# Altium schematic sheet AuxSupply_USB.SchDoc
size A4; SheetNumber: 6; SheetTotal: 10
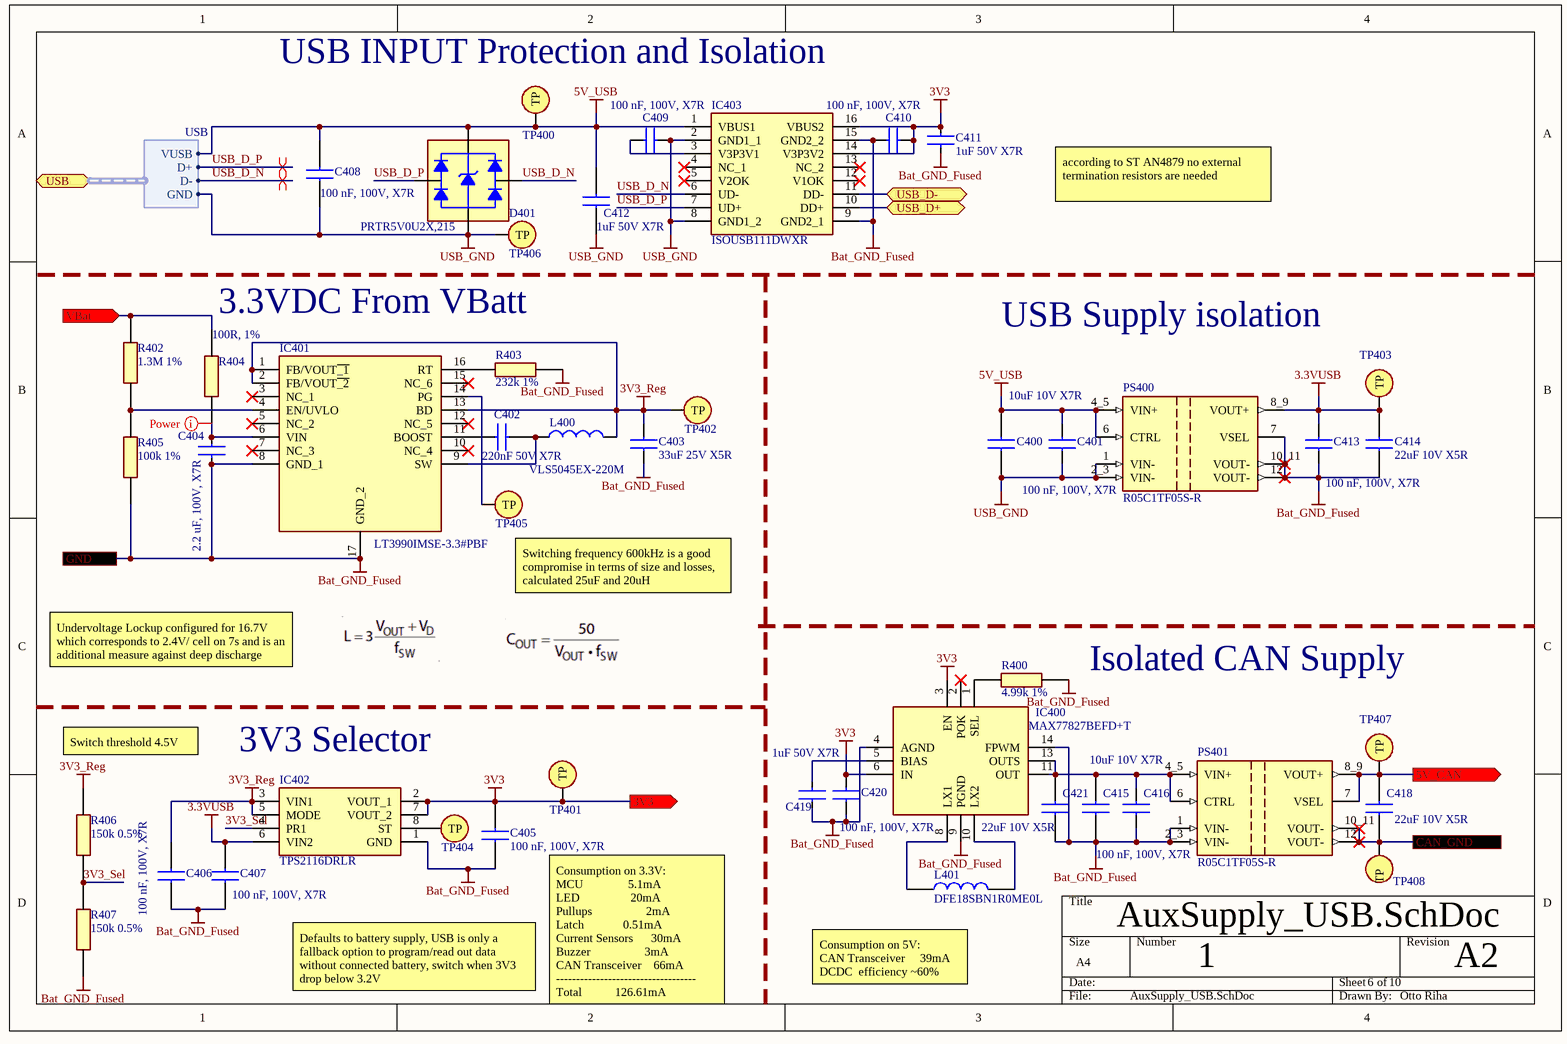
[diagram p0: AuxSupply_USB.SchDoc]

## Parts
C400  10uF 10V X7R  [GRM18x]
C401  100 nF, 100V, X7R  [MAJx16]
C402  220nF 50V X7R  [GRM18x]
C403  33uF 25V X5R  [CAPC3216X180N]
C404  2.2 uF, 100V, X7R  [CAPC2012X145N]
C405  100 nF, 100V, X7R  [MAJx16]
C406  100 nF, 100V, X7R  [MAJx16]
C407  100 nF, 100V, X7R  [MAJx16]
C408  100 nF, 100V, X7R  [MAJx16]
C409  100 nF, 100V, X7R  [MAJx16]
C410  100 nF, 100V, X7R  [MAJx16]
C411  1uF 50V X7R  [CAPC1608X90N]
C412  1uF 50V X7R  [CAPC1608X90N]
C413  100 nF, 100V, X7R  [MAJx16]
C414  22uF 10V X5R  [CAPC1608X105N]
C415  10uF 10V X7R  [GRM18x]
C416  100 nF, 100V, X7R  [MAJx16]
C418  22uF 10V X5R  [CAPC1608X105N]
C419  1uF 50V X7R  [CAPC1608X90N]
C420  100 nF, 100V, X7R  [MAJx16]
C421  22uF 10V X5R  [CAPC1608X105N]
D401  PRTR5V0U2X,215  [PRTR5V0U2X]
IC400  MAX77827BEFD+T  [MAX77827BEFDT]
IC401  LT3990IMSE-3.3#PBF  [SOP50P490X110-17N]
IC402  TPS2116DRLR  [SOTFL50P160X60-8N]
IC403  ISOUSB111DWXR  [SOP65P1030X260-16N]
L400  VLS5045EX-220M  [VLS5045EX330M]
L401  DFE18SBN1R0ME0L  [DFE18SAN1R0ME0L]
PS400  R05C1TF05S-R  [CONV_R05C1TF05S-R]
PS401  R05C1TF05S-R  [CONV_R05C1TF05S-R]
R400  4.99k 1%  [RESC0603X26N]
R402  1.3M 1%  [RESC1608X55N]
R403  232k 1%  [RESC1608X50N]
R404  100R, 1%  [RESC1608X50N]
R405  100k 1%  [RESC1608X55N]
R406  150k 0.5%  [ERA3AEB101V]
R407  150k 0.5%  [ERA3AEB101V]
TP400  Testpoint  [Testpoint]  (value not drawn)
TP401  Testpoint  [Testpoint]  (value not drawn)
TP402  Testpoint  [Testpoint]  (value not drawn)
TP403  Testpoint  [Testpoint]  (value not drawn)
TP404  Testpoint  [Testpoint]  (value not drawn)
TP405  Testpoint  [Testpoint]  (value not drawn)
TP406  Testpoint  [Testpoint]  (value not drawn)
TP407  Testpoint  [Testpoint]  (value not drawn)
TP408  Testpoint  [Testpoint]  (value not drawn)

## Ports
3V3 (out, see Main[4D], MCU[1A], PowerPath[1B], Singlepath[1B]), 5V_CAN (out, see Main[4D], MCU[1C]), CAN_GND (see Main[4D], MCU[1C]), GND (see Main[4D], LTC_Hardware[1D], MCU[1A], PowerPath[1B], Singlepath[1C]), USB (bidir, harness USB, see Main[4D]), USB_D+ (bidir, see Main[4D], MCU[4C]), USB_D- (bidir, see Main[4D], MCU[4C]), VBat (in, see Main[4D])

## Harnesses
USB: VUSB, D+, D-, GND

## Nets
3.3VUSB: C407.2 C413.1 C414.2 IC402.6(VIN2) PS400.8_9(VOUT+) TP403.1(TP)
3V3: C405.2 C410.1 C411.2 C420.1 IC400.3(EN) IC400.6(IN) IC402.2(VOUT_1) IC402.7(VOUT_2) IC403.14(V3P3V2) IC403.16(VBUS2) TP401.1(TP) ; port 3V3
3V3_Reg: C403.2 C406.2 IC401.1(FB/VOUT~{_1}) IC401.2(FB/VOUT~{_2}) IC401.13(BD) IC402.3(VIN1) IC402.5(MODE) L400.2 R406.2 TP402.1(TP)
5V_USB: C400.2 C401.1 C408.2 C412.1 D401.4(supply_voltage) IC403.1(VBUS1) PS400.4_5(VIN+) PS400.6(CTRL) TP400.1(TP) ; port USB.VUSB
Bat_GND_Fused: C403.1 C404.1 C405.1 C406.1 C407.1 C410.2 C411.1 C413.2 C414.1 C415.1 C416.2 C419.1 C420.2 C421.1 IC400.4(AGND) IC400.9(PGND) IC400.14(FPWM) IC401.8(GND_1) IC401.17(GND_2) IC402.1(GND) IC403.9(GND2_1) IC403.15(GND2_2) PS400.7(VSEL) PS400.10_11(VOUT-) PS400.12(VOUT-) PS401.1(VIN-) PS401.2_3(VIN-) R400.2 R403.2 R405.1 R407.1 ; port GND
USB_GND: C400.1 C401.2 C408.1 C409.1 C412.2 D401.1(ground) IC403.2(GND1_1) IC403.8(GND1_2) PS400.1(VIN-) PS400.2_3(VIN-) TP406.1(TP) ; port USB.GND
3V3_Sel: IC402.4(PR1) R406.1 R407.2
5V_CAN: C418.2 PS401.7(VSEL) PS401.8_9(VOUT+) TP407.1(TP) ; port 5V_CAN
CAN_GND: C418.1 PS401.10_11(VOUT-) PS401.12(VOUT-) TP408.1(TP) ; port CAN_GND
USB_D+: IC403.10(DD+) ; port USB_D+
USB_D-: IC403.11(DD-) ; port USB_D-
USB_D_N: D401.3(input/output_2) IC403.6(UD-) ; port USB.D-
USB_D_P: D401.2(input/output_1) IC403.7(UD+) ; port USB.D+
VBat: R402.2 R404.2 ; port VBat
NetC402_1: C402.1 IC401.11(BOOST)
NetC402_2: C402.2 IC401.9(SW) L400.1
NetC404_2: C404.2 IC401.6(VIN) R404.1
NetC409_2: C409.2 IC403.3(V3P3V1)
NetC415_2: C415.2 C416.1 C421.2 IC400.11(OUT) IC400.13(OUTS) PS401.4_5(VIN+) PS401.6(CTRL)
NetC419_2: C419.2 IC400.5(BIAS)
NetIC400_1: IC400.1(SEL) R400.1
NetIC400_8: IC400.8(LX1) L401.1
NetIC400_10: IC400.10(LX2) L401.2
NetIC401_4: IC401.4(EN/UVLO) R402.1 R405.2
NetIC401_14: IC401.14(PG) TP405.1(TP)
NetIC401_16: IC401.16(RT) R403.1
NetIC402_8: IC402.8(ST) TP404.1(TP)

Not connected (* = marked no-connect by the designer): IC400 2(POK)*; IC401 3(NC_1)* 5(NC_2)* 7(NC_3)* 10(NC_4)* 12(NC_5)* 15(NC_6)*; IC403 4(NC_1)* 5(V2OK)* 12(V1OK)* 13(NC_2)*

## Layout directives
differential pair: USB_D_N, USB_D_P
net class Batt+: NetC404_2

## Notes on the sheet
- USB INPUT Protection and Isolation
- according to ST AN4879 no external termination resistors are needed
- 3.3VDC From VBatt
- USB Supply isolation
- (near TP405) Switching frequency 600kHz is a good compromise in terms of size and losses, calculated 25uF and 20uH
- Undervoltage Lockup configured for 16.7V which corresponds to 2.4V/ cell on 7s and is an additional measure against deep discharge
- Isolated CAN Supply
- Switch threshold 4.5V
- (near IC402) 3V3 Selector
- Defaults to battery supply, USB is only a fallback option to program/read out data without connected battery, switch when 3V3 drop below 3.2V
- (near L401) Consumption on 5V:
  CAN Transceiver     39mA
  DCDC  efficiency ~60%
- 1
- A2
- Consumption on 3.3V:
  MCU 	             5.1mA
  LED  	              20mA
  Pullups 	                2mA
  Latch 	           0.51mA
  Current Sensors      30mA
  Buzzer 	                3mA
  CAN Transceiver    66mA
  -----------------------------------
  Total 	         126.61mA
- Otto Riha

## Library data of the parts
C400 C415 = GRM188Z71A106MA73D: Capacitor; Manufacturer_Name: Murata Electronics; Datasheet Link: https://search.murata.co.jp/Ceramy/image/img/A01X/G101/ENG/GRM188Z71A106MA73-01A.pdf; Height: 0.9mm; Manufacturer_Part_Number: GRM188Z71A106MA73D; Mouser Part Number: 81-GRM188Z71A106MA3D; Mouser Price/Stock: https://www.mouser.co.uk/ProductDetail/Murata-Electronics/GRM188Z71A106MA73D?qs=Y%252BBGkTaltXt4aDn0%2FsxyNQ%3D%3D; Arrow Part Number: GRM188Z71A106MA73D; Arrow Price/Stock: https://www.arrow.com/en/products/grm188z71a106ma73d/murata-manufacturing?utm_currency=USD&region=europe
C401 C405-C410 C413 C416 C420 = MAJCH168BB7104KTEA01: Capacitor 100nF, 100V, X7R; Manufacturer_Name: TAIYO YUDEN; Datasheet Link: https://ds.yuden.co.jp/TYCOMPAS/or/detail?pn=MAJCH168BB7104KTEA01; Height: 0.8mm; Manufacturer_Part_Number: MAJCH168BB7104KTEA01; Mouser Part Number: 963-MAJCH168BB7104KT; Mouser Price/Stock: https://www.mouser.co.uk/ProductDetail/TAIYO-YUDEN/MAJCH168BB7104KTEA01?qs=ZcfC38r4PovaTBrG0IdezQ%3D%3D; Arrow Part Number: MAJCH168BB7104KTEA01; Arrow Price/Stock: https://www.arrow.com/en/products/majch168bb7104ktea01/taiyo-yuden?utm_currency=USD&region=nac; Supplier 1: Mouser; Supplier Part Number 1: 963-MAJCH168BB7104KT
C402 = GRM188R71H224KAC4J: Capacitor; Manufacturer_Name: Murata Electronics; Datasheet Link: https://search.murata.co.jp/Ceramy/image/img/A01X/G101/ENG/GRM188R71H224KAC4-01A.pdf; Height: 0.9mm; Manufacturer_Part_Number: GRM188R71H224KAC4J; Mouser Part Number: 81-GRM188R71H224KA4J; Mouser Price/Stock: https://www.mouser.co.uk/ProductDetail/Murata-Electronics/GRM188R71H224KAC4J?qs=jHkklCh7amjbWVXSvnFGBA%3D%3D; Arrow Part Number: GRM188R71H224KAC4J; Arrow Price/Stock: https://www.arrow.com/en/products/grm188r71h224kac4j/murata-manufacturing
C403 = C3216X5R1E336M160AC: Capacitor 33uF 25V X5R; Manufacturer_Name: TDK; Datasheet Link: https://product.tdk.com/info/en/catalog/datasheets/mlcc_commercial_midvoltage_en.pdf; Height: 1.8mm; Manufacturer_Part_Number: C3216X5R1E336M160AC; Mouser Part Number: 810-C3216X5R1E336M; Mouser Price/Stock: https://www.mouser.co.uk/ProductDetail/TDK/C3216X5R1E336M160AC?qs=LcTL%2F5vFEzFIMvFz4LzwTw%3D%3D; Arrow Part Number: C3216X5R1E336M160AC; Arrow Price/Stock: https://www.arrow.com/en/products/c3216x5r1e336m160ac/tdk
C404 = C2012X7R2A225K125AC: Capacitor 2.2 uF, 100V, X7R; Manufacturer_Name: TDK; Datasheet Link: https://product.tdk.com/info/en/catalog/datasheets/mlcc_commercial_midvoltage_en.pdf; Height: 1.45mm; Manufacturer_Part_Number: C2012X7R2A225K125AC; Mouser Part Number: 810-C2012X7R2225K125; Mouser Price/Stock: https://www.mouser.co.uk/ProductDetail/TDK/C2012X7R2A225K125AC?qs=17ckDYBRdekDf%2FwiwHq7Mg%3D%3D; Arrow Part Number: C2012X7R2A225K125AC; Arrow Price/Stock: https://www.arrow.com/en/products/c2012x7r2a225k125ac/tdk?utm_currency=USD&region=nac; Supplier 1: Mouser; Supplier Part Number 1: 810-C2012X7R2225K125
C411 C412 C419 = 06035C105MAT2A: Capacitor 1uF 50V X7R; Manufacturer_Name: Kyocera AVX; Datasheet Link: https://componentsearchengine.com/Datasheets/1/06031A100FAT2A.pdf; Height: 0.9mm; Manufacturer_Part_Number: 06035C105MAT2A; Mouser Part Number: 581-06035C105MAT2A; Mouser Price/Stock: https://www.mouser.co.uk/ProductDetail/KYOCERA-AVX/06035C105MAT2A?qs=%252BdQmOuGyFcHMsevPtc6OZQ%3D%3D; Value: 1uF
C414 C418 C421 = CL10A226MP8NUNE: Capacitor; Manufacturer_Name: SAMSUNG; Datasheet Link: https://datasheet.datasheetarchive.com/originals/distributors/Datasheets-DGA10/2407063.pdf; Height: 1.05mm; Manufacturer_Part_Number: CL10A226MP8NUNE; Mouser Part Number: 187-CL10A226MP8NUNE; Mouser Price/Stock: https://www.mouser.co.uk/ProductDetail/Samsung-Electro-Mechanics/CL10A226MP8NUNE?qs=gRKWieUq2Hb5O0PTfRKzDQ%3D%3D; Arrow Part Number: CL10A226MP8NUNE; Arrow Price/Stock: https://www.arrow.com/en/products/cl10a226mp8nune/samsung-electro-mechanics?region=europe
D401 = PRTR5V0U2X,215: Diode; Manufacturer_Name: Nexperia; Datasheet Link: https://assets.nexperia.com/documents/data-sheet/PRTR5V0U2X.pdf; Height: 1.1mm; Manufacturer_Part_Number: PRTR5V0U2X,215; Mouser Part Number: 771-PRTR5V0U2X-T/R; Mouser Price/Stock: https://www.mouser.co.uk/ProductDetail/Nexperia/PRTR5V0U2X215?qs=LOCUfHb8d9sDkgY4cRj8Lw%3D%3D; Arrow Part Number: PRTR5V0U2X,215; Arrow Price/Stock: https://www.arrow.com/en/products/prtr5v0u2x215/nexperia?utm_currency=USD&region=europe
IC400 = MAX77827BEFD+T: Integrated Circuit; Manufacturer_Name: Analog Devices; Datasheet Link: https://www.analog.com/media/en/technical-documentation/data-sheets/MAX77827.pdf; Height: 0.6mm; Manufacturer_Part_Number: MAX77827BEFD+T; Mouser Part Number: 700-MAX77827BEFD+T; Mouser Price/Stock: https://www.mouser.co.uk/ProductDetail/Analog-Devices-Maxim-Integrated/MAX77827BEFD%2bT?qs=yqaQSyyJnNgFOTHEkqA3ww%3D%3D; Arrow Part Number: MAX77827BEFD+T; Arrow Price/Stock: https://www.arrow.com/en/products/max77827befdt/analog-devices?utm_currency=USD&region=nac
IC401 = LT3990IMSE-3.3#PBF: Integrated Circuit; Manufacturer_Name: Analog Devices; Datasheet Link: https://www.analog.com/LT3990/datasheet; Height: 1.1mm; Manufacturer_Part_Number: LT3990IMSE-3.3#PBF; Mouser Part Number: 584-3990IMSE-3.3PBF; Mouser Price/Stock: https://www.mouser.co.uk/ProductDetail/Analog-Devices/LT3990IMSE-3.3PBF?qs=hVkxg5c3xu8pU5y8AinUWQ%3D%3D; Arrow Part Number: LT3990IMSE-3.3#PBF; Arrow Price/Stock: https://www.arrow.com/en/products/lt3990imse-3.3pbf/analog-devices?region=nac
IC402 = TPS2116DRLR: Integrated Circuit; Manufacturer_Name: Texas Instruments; Datasheet Link: https://www.ti.com/lit/gpn/tps2116; Height: 0.6mm; Manufacturer_Part_Number: TPS2116DRLR; Mouser Part Number: 595-TPS2116DRLR; Mouser Price/Stock: https://www.mouser.co.uk/ProductDetail/Texas-Instruments/TPS2116DRLR?qs=aP1CjGhiNiGo3XAyXcVPaQ%3D%3D; Arrow Part Number: TPS2116DRLR; Arrow Price/Stock: https://www.arrow.com/en/products/tps2116drlr/texas-instruments?utm_currency=USD&region=nac
IC403 = ISOUSB111DWXR: Integrated Circuit; Manufacturer_Name: Texas Instruments; Datasheet Link: https://www.ti.com/lit/ds/symlink/isousb111.pdf?ts=1669697942868&ref_url=https%253A%252F%252Fwww.ti.com%252Fproduct%252FISOUSB111%253FkeyMatch%253DISOUSB111DWXR%2526tisearch%253Dsearch-everything%2526usecase%253DOPN; Height: 2.6mm; Manufacturer_Part_Number: ISOUSB111DWXR; Mouser Part Number: 595-ISOUSB111DWXR; Mouser Price/Stock: https://www.mouser.co.uk/ProductDetail/Texas-Instruments/ISOUSB111DWXR?qs=Y0Uzf4wQF3msEozH7EwD3g%3D%3D; Arrow Part Number: ISOUSB111DWXR; Arrow Price/Stock: https://www.arrow.com/en/products/isousb111dwxr/texas-instruments?region=nac
L400 = VLS5045EX-220M: Inductor; Manufacturer_Name: TDK; Datasheet Link: https://product.tdk.com/system/files/dam/doc/product/inductor/inductor/smd/catalog/inductor_commercial_power_vls5045ex_en.pdf; Height: 4mm; Manufacturer_Part_Number: VLS5045EX-220M; Mouser Part Number: 810-VLS5045EX-220M; Mouser Price/Stock: https://www.mouser.co.uk/ProductDetail/TDK/VLS5045EX-220M?qs=oF%2FSscNnLpAAQL9ec5VdpA%3D%3D; Arrow Part Number: VLS5045EX-220M; Arrow Price/Stock: https://www.arrow.com/en/products/vls5045ex-220m/tdk?region=nac
L401 = DFE18SBN1R0ME0L: Inductor; Manufacturer_Name: Murata Electronics; Datasheet Link: https://search.murata.co.jp/Ceramy/image/img/P02/JETE243A-0041.pdf; Height: 0.8mm; Manufacturer_Part_Number: DFE18SBN1R0ME0L; Mouser Part Number: 81-DFE18SBN1R0ME0L; Mouser Price/Stock: https://www.mouser.co.uk/ProductDetail/Murata-Electronics/DFE18SBN1R0ME0L?qs=byeeYqUIh0Mps9dQtDnpsA%3D%3D
PS400 PS401 = R05C1TF05S-R: MF: {'manufacturer': u'Recom Power'}; Package: None; Price: None; Value: *; MP: R05C1TF05S-R; Availability: Unavailable
R400 = CR0201-FW-4991GLF: Resistor; Manufacturer_Name: Bourns; Datasheet Link: https://www.bourns.com/pdfs/chpreztr.pdf; Height: 0.26mm; Manufacturer_Part_Number: CR0201-FW-4991GLF; Mouser Part Number: 652-CR0201FW-4991GLF; Mouser Price/Stock: https://www.mouser.co.uk/ProductDetail/Bourns/CR0201-FW-4991GLF?qs=W7X4MxMep48JtJbJXkcmpg%3D%3D
R402 = MCT0603MD1304BP500: Resistor 1.3M 1%; Manufacturer_Name: Vishay; Datasheet Link: http://www.vishay.com/docs/28705/mcx0x0xpro.pdf; Height: 0.55mm; Manufacturer_Part_Number: MCT0603MD1304BP500; Mouser Part Number: 594-MCT0603MD1304BP5; Mouser Price/Stock: https://www.mouser.co.uk/ProductDetail/Vishay/MCT0603MD1304BP500?qs=Jslch3jnSjn3NEL17BAJuQ%3D%3D; Value: 1.3M; Supplier 1: Mouser; Supplier Part Number 1: 594-MCT0603MD1304BP5
R403 = CRCW0603232KFKEA: Resistor; Manufacturer_Name: Vishay; Datasheet Link: http://www.vishay.com/docs/20035/dcrcwe3.pdf; Height: 0.5mm; Manufacturer_Part_Number: CRCW0603232KFKEA; Mouser Part Number: 71-CRCW0603-232K-E3; Mouser Price/Stock: https://www.mouser.co.uk/ProductDetail/Vishay-Dale/CRCW0603232KFKEA?qs=NHKSztHah43mx5UrSmXOxA%3D%3D; Arrow Part Number: CRCW0603232KFKEA; Arrow Price/Stock: https://www.arrow.com/en/products/crcw0603232kfkea/vishay
R404 = CRCW0603100RFKEA: Resistor 100R, 1%; Manufacturer_Name: Vishay; Datasheet Link: http://www.vishay.com/docs/20035/dcrcwe3.pdf; Height: 0.5mm; Manufacturer_Part_Number: CRCW0603100RFKEA; Mouser Part Number: 71-CRCW0603-100-E3; Mouser Price/Stock: https://www.mouser.co.uk/ProductDetail/Vishay-Dale/CRCW0603100RFKEA?qs=90AHS1y%2FsidGWjjxZAupKg%3D%3D; Arrow Part Number: CRCW0603100RFKEA; Arrow Price/Stock: https://www.arrow.com/en/products/crcw0603100rfkea/vishay?utm_currency=USD&region=europe; Value: 100R; Supplier 1: Mouser; Supplier Part Number 1: 71-CRCW0603-100-E3
R405 = CRCW0603100KFKEAC: Resistor 100k, 1%; Manufacturer_Name: Vishay; Datasheet Link: https://www.mouser.com/datasheet/2/427/crcwce3-1223726.pdf; Height: 0.55mm; Manufacturer_Part_Number: CRCW0603100KFKEAC; Mouser Part Number: 71-CRCW0603100KFKEAC; Mouser Price/Stock: https://www.mouser.co.uk/ProductDetail/Vishay-Dale/CRCW0603100KFKEAC?qs=E3Y5ESvWgWPxzfNYyMgX1w%3D%3D; Arrow Part Number: CRCW0603100KFKEAC; Arrow Price/Stock: https://www.arrow.com/en/products/crcw0603100kfkeac/vishay?utm_currency=USD&region=nac; Value: 100k; Supplier 1: Mouser; Supplier Part Number 1: 71-CRCW0603100KFKEAC
R406 R407 = ERA-3AED154V: Resistor 150k 0.5%; Manufacturer_Name: Panasonic; Datasheet Link: https://industrial.panasonic.com/cdbs/www-data/pdf/RDM0000/AOA0000C307.pdf; Height: 0.55mm; Manufacturer_Part_Number: ERA-3AED154V; Mouser Part Number: 667-ERA-3AED154V; Mouser Price/Stock: https://www.mouser.co.uk/ProductDetail/Panasonic/ERA-3AED154V?qs=MNPzkKEzRtSm98HasUBZjQ%3D%3D; Arrow Part Number: ERA-3AED154V; Arrow Price/Stock: https://www.arrow.com/en/products/era-3aed154v/panasonic?region=nac; Supplier 1: Mouser; Supplier Part Number 1: 667-ERA-3AED154V